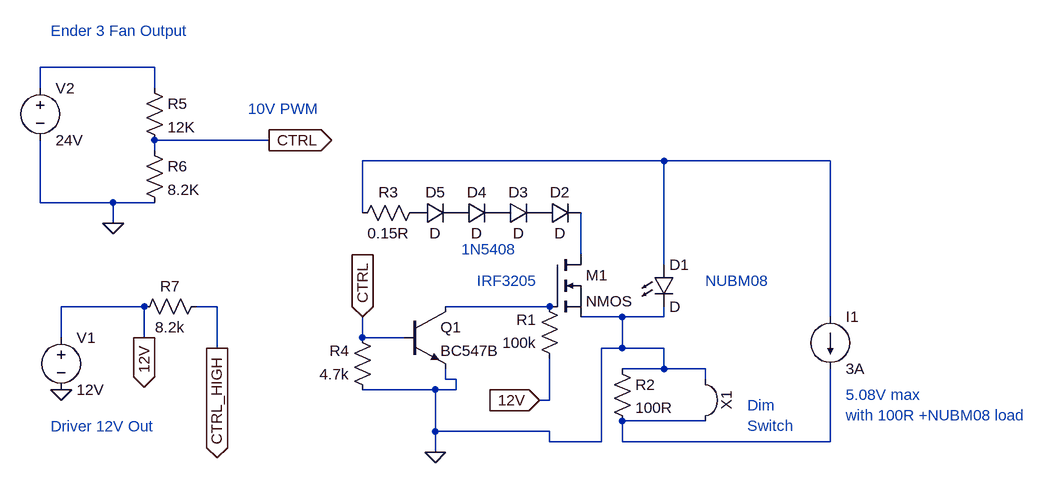
[diagram p0: schematic Draft1.asc]
Draft1.asc, the LTspice schematic file:
Version 4
SHEET 1 880 680
WIRE -496 -352 -672 -352
WIRE -672 -320 -672 -352
WIRE -496 -320 -496 -352
WIRE -320 -240 -496 -240
WIRE -496 -224 -496 -240
WIRE 288 -208 -176 -208
WIRE 544 -208 288 -208
WIRE -672 -144 -672 -240
WIRE -560 -144 -672 -144
WIRE -496 -144 -560 -144
WIRE -176 -128 -176 -208
WIRE -560 -112 -560 -144
WIRE 160 -64 160 -128
WIRE 288 -48 288 -208
WIRE -512 16 -640 16
WIRE -400 16 -432 16
WIRE 112 16 -48 16
WIRE 224 32 160 32
WIRE 288 32 288 16
WIRE 288 32 224 32
WIRE 544 32 544 -208
WIRE -640 64 -640 16
WIRE -512 64 -512 16
WIRE -176 64 -176 32
WIRE -112 64 -176 64
WIRE -400 80 -400 16
WIRE 224 80 224 32
WIRE 224 80 192 80
WIRE 288 80 224 80
WIRE 288 112 288 80
WIRE 288 112 224 112
WIRE 352 112 288 112
WIRE -48 128 -48 112
WIRE -32 128 -48 128
WIRE 352 128 352 112
WIRE -64 144 -176 144
WIRE -32 144 -32 128
WIRE -32 144 -64 144
WIRE 112 160 112 96
WIRE 112 160 96 160
WIRE 352 192 224 192
WIRE -64 208 -64 144
WIRE 112 208 -64 208
WIRE 112 224 112 208
WIRE 192 224 192 80
WIRE 192 224 112 224
WIRE 224 224 224 192
WIRE 544 224 544 112
WIRE 544 224 224 224
WIRE -64 240 -64 208
FLAG -560 -112 0
FLAG -64 240 0
FLAG -320 -240 CTRL
IOPIN -320 -240 Out
FLAG -176 32 CTRL
IOPIN -176 32 In
FLAG 96 160 12V
IOPIN 96 160 In
FLAG -640 144 0
FLAG -512 64 12V
IOPIN -512 64 Out
FLAG -400 80 CTRL_HIGH
IOPIN -400 80 Out
SYMBOL current 544 32 R0
WINDOW 123 0 0 Left 0
WINDOW 39 0 0 Left 0
SYMATTR InstName I1
SYMATTR Value 3A
SYMBOL nmos 112 -64 R0
SYMATTR InstName M1
SYMBOL LED 272 -48 R0
SYMATTR InstName D1
SYMBOL npn -112 16 R0
SYMATTR InstName Q1
SYMATTR Value BC547B
SYMBOL res 208 96 R0
SYMATTR InstName R2
SYMATTR Value 100R
SYMATTR SpiceLine pwr=1
SYMBOL diode 96 -112 R270
WINDOW 0 32 32 VTop 2
WINDOW 3 0 32 VBottom 2
SYMATTR InstName D2
SYMBOL diode 32 -112 R270
WINDOW 0 32 32 VTop 2
WINDOW 3 0 32 VBottom 2
SYMATTR InstName D3
SYMBOL diode -32 -112 R270
WINDOW 0 32 32 VTop 2
WINDOW 3 0 32 VBottom 2
SYMATTR InstName D4
SYMBOL diode -96 -112 R270
WINDOW 0 32 32 VTop 2
WINDOW 3 0 32 VBottom 2
SYMATTR InstName D5
SYMBOL res -80 -144 R90
WINDOW 0 0 56 VBottom 2
WINDOW 3 32 56 VTop 2
SYMATTR InstName R3
SYMATTR Value 0.15R
SYMATTR SpiceLine pwr=3
SYMBOL res -160 160 R180
WINDOW 0 36 76 Left 2
WINDOW 3 36 40 Left 2
SYMATTR InstName R4
SYMATTR Value 4.7k
SYMBOL res 128 112 R180
WINDOW 0 36 76 Left 2
WINDOW 3 36 40 Left 2
SYMATTR InstName R1
SYMATTR Value 100k
SYMBOL Misc\\jumper 416 160 R90
SYMATTR InstName X1
SYMBOL voltage -672 -336 R0
WINDOW 123 0 0 Left 0
WINDOW 39 0 0 Left 0
SYMATTR InstName V2
SYMATTR Value 24V
SYMBOL res -512 -336 R0
SYMATTR InstName R5
SYMATTR Value 12K
SYMBOL res -512 -240 R0
SYMATTR InstName R6
SYMATTR Value 8.2K
SYMBOL voltage -640 48 R0
WINDOW 123 0 0 Left 0
WINDOW 39 0 0 Left 0
SYMATTR InstName V1
SYMATTR Value 12V
SYMBOL res -416 0 R90
WINDOW 0 0 56 VBottom 2
WINDOW 3 32 56 VTop 2
SYMATTR InstName R7
SYMATTR Value 8.2k
TEXT 416 168 Left 2 ;Dim\nSwitch
TEXT 568 152 Left 2 ;5.08V max\nwith 100R +NUBM08 load
TEXT -24 -72 Left 2 ;1N5408
TEXT 0 -24 Left 2 ;IRF3205
TEXT 352 -24 Left 2 ;NUBM08
TEXT -656 -408 Left 2 ;Ender 3 Fan Output
TEXT -352 -288 Left 2 ;10V PWM
TEXT -656 200 Left 2 ;Driver 12V Out

The netlist it stands for:
* Draft1.asc
I1 N002 0 3A
M1 N003 N004 0 0 NMOS
D1 N002 0 D
Q1 N004 CTRL 0 0 BC547B
R2 0 0 100R pwr=1
D2 P001 N003 D
D3 P002 P001 D
D4 P003 P002 D
D5 P004 P003 D
R3 P004 N002 0.15R pwr=3
R4 0 CTRL 4.7k
R1 12V N004 100k
V2 N001 0 24V
R5 N001 CTRL 12K
R6 CTRL 0 8.2K
V1 12V 0 12V
R7 CTRL_HIGH 12V 8.2k
.model D D
.lib standard.dio
.model NPN NPN
.model PNP PNP
.lib standard.bjt
.model NMOS NMOS
.model PMOS PMOS
.lib standard.mos
* Dim
* Switch
* 5.08V max
* with 100R +NUBM08 load
* 1N5408
* IRF3205
* NUBM08
* Ender 3 Fan Output
* 10V PWM
* Driver 12V Out
.backanno
.end